# Altium schematic sheet GENERAL.SchDoc
size A4; SheetNumber: 1; SheetTotal: 5
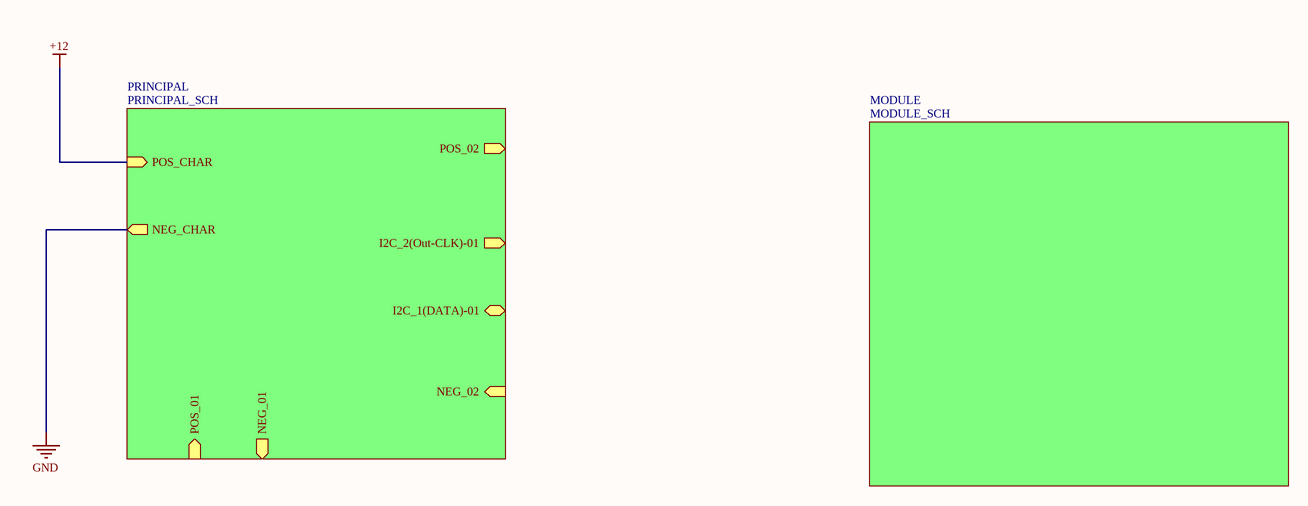
[diagram p0: GENERAL.SchDoc]

## Sub-sheets
MODULE = MODULE_SCH: no entries
PRINCIPAL = PRINCIPAL_SCH: POS_02 (out), I2C_2(Out-CLK)-01 (out), I2C_1(DATA)-01 (bidir), NEG_02 (in), POS_CHAR (in), NEG_CHAR (out), POS_01 (in), NEG_01 (out)

## Nets
+12: sheet PRINCIPAL/POS_CHAR
GND: sheet PRINCIPAL/NEG_CHAR